# EAGLE schematic untitled (EAGLE 9.6.2)
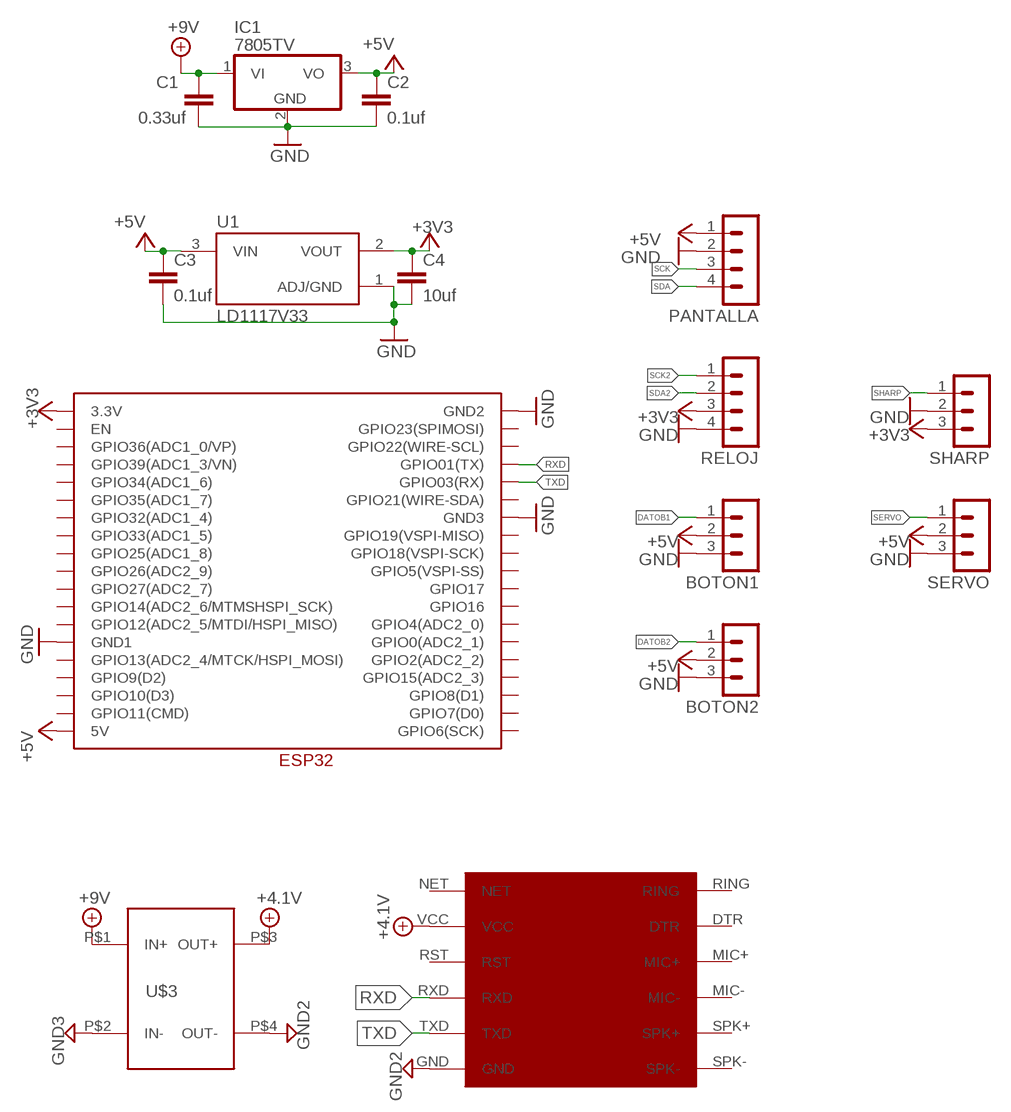
[diagram p0: schematic, sheet 1]

## Parts
BOTON1  MA03-1  [MA03-1]
BOTON2  MA03-1  [MA03-1]
C1  0.33uf  C2,5-3  [C2.5-3]
C2  0.1uf  C2,5-3  [C2.5-3]
C3  0.1uf  C2,5-3  [C2.5-3]
C4  10uf  C2,5-3  [C2.5-3]
IC1  7805TV  [TO220V]
PANTALLA  MA04-1  [MA04-1]
RELOJ  MA04-1  [MA04-1]
SERVO  MA03-1  [MA03-1]
SHARP  MA03-1  [MA03-1]
U1  LD1117V33  [TO255P1020X450X1968-3]
U$1  ESP32WESP32W  [ESP32W]
U$2  SIM800L  [SIM800L]
U$3  XL6009E1  [XL6009E1]

## Nets
+3V3: C4.1 RELOJ.3 SHARP.3 U1.2(VOUT) U$1.3.3V
+4.1V: U$2.VCC U$3.P$3(OUT+)
+5V: BOTON1.2 BOTON2.2 C2.1 C3.1 IC1.3(VO) PANTALLA.1 SERVO.2 U1.3(VIN) U$1.5V
+9V: C1.1 IC1.1(VI) U$3.P$1(IN+)
DATOB1: BOTON1.1
DATOB2: BOTON2.1
GND: BOTON1.3 BOTON2.3 C1.2 C2.2 C3.2 C4.2 IC1.2(GND) PANTALLA.2 RELOJ.4 SERVO.3 SHARP.2 U1.1(ADJ/GND) U$1.GND1 U$1.GND2 U$1.GND3
GND2: U$2.GND U$3.P$4(OUT-)
GND3: U$3.P$2(IN-)
RXD: U$1.TX(GPIO01(TX)) U$2.RXD
SCK: PANTALLA.3
SCK2: RELOJ.1
SDA: PANTALLA.4
SDA2: RELOJ.2
SERVO: SERVO.1
SHARP: SHARP.1
TXD: U$1.RX(GPIO03(RX)) U$2.TXD
Unconnected: U$1.CLK(GPIO6(SCK)) U$1.CMD(GPIO11(CMD)) U$1.D2(GPIO9(D2)) U$1.D3(GPIO10(D3)) U$1.EN U$1.GPIO0(GPIO0(ADC2_1)) U$1.GPIO2(GPIO2(ADC2_2)) U$1.GPIO4(GPIO4(ADC2_0)) U$1.GPIO5(GPIO5(VSPI-SS)) U$1.GPIO12(GPIO12(ADC2_5/MTDI/HSPI_MISO)) U$1.GPIO13(GPIO13(ADC2_4/MTCK/HSPI_MOSI)) U$1.GPIO14(GPIO14(ADC2_6/MTMSHSPI_SCK)) U$1.GPIO15(GPIO15(ADC2_3)) U$1.GPIO16 U$1.GPIO17 U$1.GPIO18(GPIO18(VSPI-SCK)) U$1.GPIO19(GPIO19(VSPI-MISO)) U$1.GPIO21(GPIO21(WIRE-SDA)) U$1.GPIO22(GPIO22(WIRE-SCL)) U$1.GPIO23(GPIO23(SPIMOSI)) U$1.GPIO25(GPIO25(ADC1_8)) U$1.GPIO26(GPIO26(ADC2_9)) U$1.GPIO27(GPIO27(ADC2_7)) U$1.GPIO32(GPIO32(ADC1_4)) U$1.GPIO33(GPIO33(ADC1_5)) U$1.GPIO34(GPIO34(ADC1_6)) U$1.GPIO35(GPIO35(ADC1_7)) U$1.SDI(GPIO8(D1)) U$1.SDO(GPIO7(D0)) U$1.VN(GPIO39(ADC1_3/VN)) U$1.VP(GPIO36(ADC1_0/VP)) U$2.DTR U$2.MIC+ U$2.MIC- U$2.NET U$2.RING U$2.RST U$2.SPK+ U$2.SPK-

## Library data of the parts
BOTON1 BOTON2 SERVO SHARP = con-lstb:MA03-1: PIN HEADER; OC_FARNELL: unknown; OC_NEWARK: unknown
C1-C4 = capacitor-wima:C: CAPACITOR naming: grid - package width
IC1 = linear:78*: Positive VOLTAGE REGULATOR Source: http://cache.national.com/ds/LM/LM78L05.pdf http://www.fairchildsemi.com/ds/LM/LM7805.pdf
PANTALLA RELOJ = con-lstb:MA04-1: PIN HEADER; OC_FARNELL: unknown; OC_NEWARK: unknown
U1 = LD1117V33:LD1117V33: Check availability <https://pricing.snapeda.com/parts/LD1117V33/STMicroelectronics/view-part?ref=eda>; AVAILABILITY: In Stock; DESCRIPTION: Linear Voltage Regulator IC Positive Fixed 1 Output 800mA TO-220AB; MF: STMicroelectronics; MP: LD1117V33; PACKAGE: TO-220-3 STMicroelectronics; PRICE: None; PURCHASE-URL: https://pricing.snapeda.com/search?q=LD1117V33&ref=eda
U$1 = ESP32-WROOM2:ESP32W
U$2 = SIM800L:SIM800L
U$3 = XL6009E1:XL6009E1: Regulador-elevador de voltaje de alto rendimiento de conmutación (BOOST). -Voltaje de entrada: 3 ~ 32 V (voltaje óptimo 5 ~ 32 V -Intensidad máxima de entrada: 4A -Intensidad máxima de salida: 3A - sin disipador puede entregar hasta 2 A